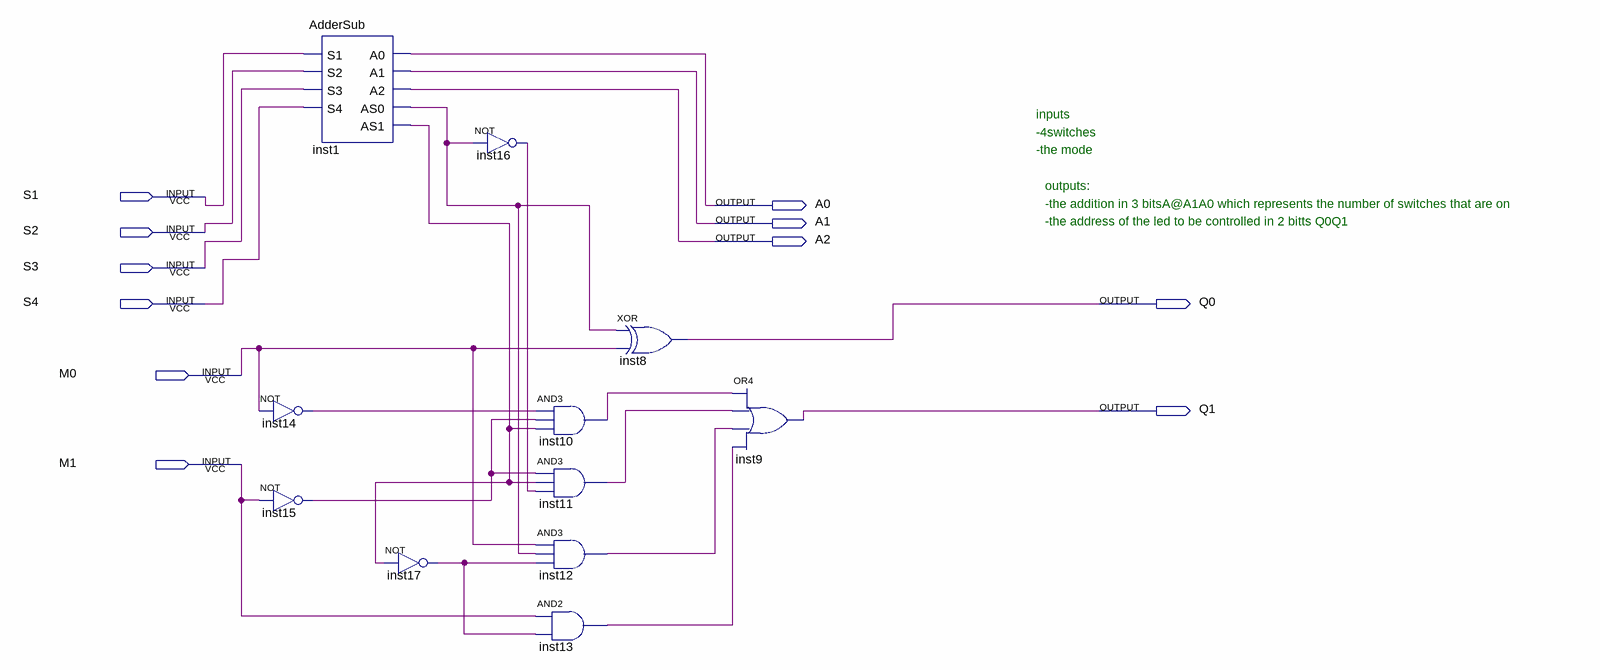
[diagram p0: schematic sheet]
// Quartus schematic CounterWModes.bdf as structural Verilog: 11 symbols, 11 pins
module CounterWModes (
  input  S1,
  input  S2,
  input  S3,
  input  S4,
  input  M0,
  input  M1,
  output A0,
  output A1,
  output A2,
  output Q0,
  output Q1
);

  wire inst1_as0, inst1_as1, inst10_out, inst11_out, inst12_out, inst13_out, inst14_out, inst15_out,
       inst16_out, inst17_out;

  not inst14 (inst14_out, M0);
  not inst15 (inst15_out, M1);
  AdderSub inst1 (.S1(S1), .S2(S2), .S3(S3), .S4(S4), .A0(A0), .A1(A1), .A2(A2), .AS0(inst1_as0), .AS1(inst1_as1));
  not inst17 (inst17_out, inst1_as1);
  not inst16 (inst16_out, inst1_as0);
  and inst10 (inst10_out, inst14_out, inst15_out, inst1_as1);
  and inst11 (inst11_out, inst15_out, inst1_as1, inst16_out);
  and inst12 (inst12_out, M0, inst1_as0, inst17_out);
  and inst13 (inst13_out, M1, inst17_out);
  xor inst8 (Q0, inst1_as0, M0);
  or inst9 (Q1, inst10_out, inst11_out, inst12_out, inst13_out);

  // Notes on the sheet:
  //   inputs
  //   -4switches
  //   -the mode
  //   outputs:
  //   -the addition in 3 bitsA@A1A0 which represents the number of switches that are on
  //   -the address of the led to be controlled in 2 bitts Q0Q1
endmodule
